# EasyEDA Pro project ProDocument_N64 SpyDVI QSB Compat_2024-08-22.epro

# Schematic QSBC
Board Name: N64 SpyDVI QSB; Create Date: 2024-08-22; Page Name: Schematic; Project Name: SpyDVI-QSB; Schematic Name: Schematic1; Update Date: 2024-08-22; Add into BOM: yes; Company: Chobrenga; Convert to PCB: yes; Date: 2024-02-21; Draw By: Chobrenga; REV: 1.0C; Sheet: 1/1
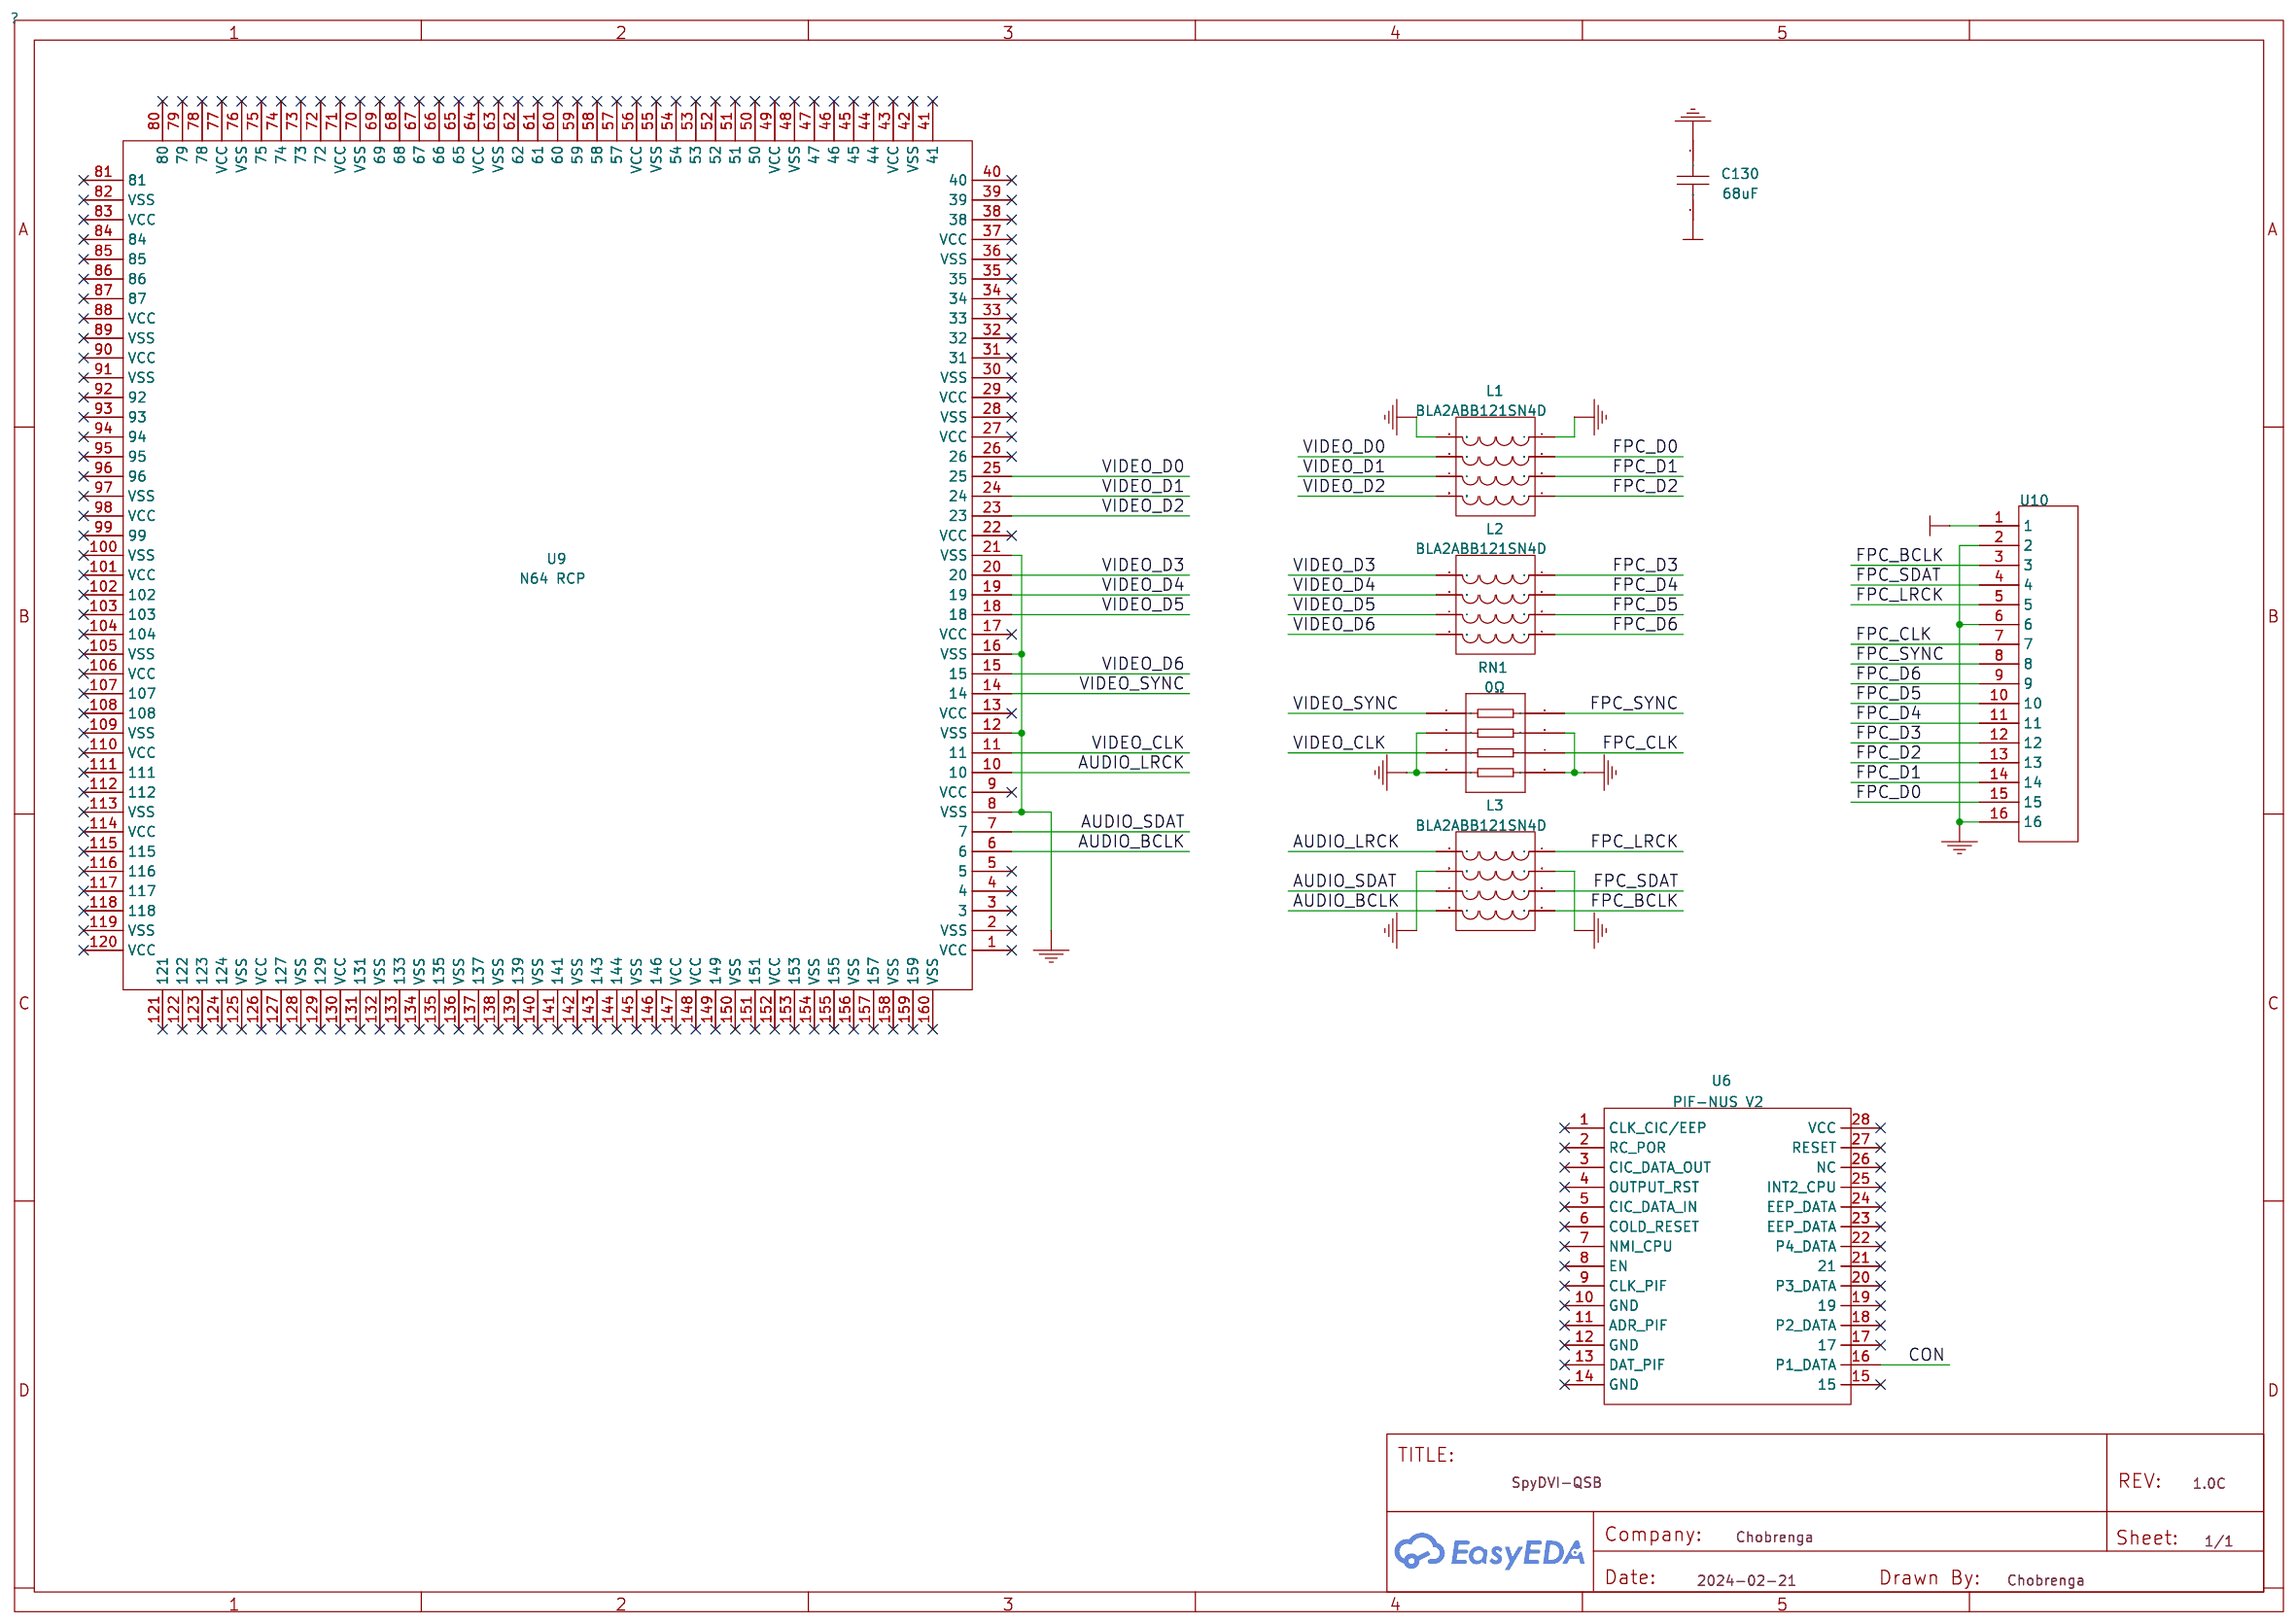
[diagram p0: schematic sheet]

## Parts
C130  68uF  (no BOM)
L1  BLA2ABB121SN4D  [BEAD-SMD_8P-L2.0-W1.0-P0.50-TL]
L2  BLA2ABB121SN4D  [BEAD-SMD_8P-L2.0-W1.0-P0.50-TL]
L3  BLA2ABB121SN4D  [BEAD-SMD_8P-L2.0-W1.0-P0.50-TL]
RN1  0Ω  [RES-ARRAY-SMD_0402-8P-L2.0-W1.0-BL]
U6  PIF-NUS V2  (no BOM)
U9  N64 RCP  [RCP NUS]  (no BOM)
U10  -  [16P_Ribbon]  (no BOM)

## Library data of the parts
C130 = 68uF
L1-L3 = BLA2ABB121SN4D: Supplier: LCSC; Supplier Part: C440126; Manufacturer: muRata(村田); JLCPCB Part Class: Extended Part
RN1 = 0Ω: Supplier: LCSC; Manufacturer: FH(风华); Manufacturer Part: RC-MT08W000JT; Supplier Part: C2001; JLCPCB Part Class: Extended Part
U6 = PIF-NUS V2
U9 = N64 RCP
U10 = 16P_Ribbon: For : AFA01-S16FCA-00

## Nets
+5V: C130.2 U10.1
GND: C130.1 L1.4 L1.5 L3.3 L3.6 RN1.1 RN1.3 RN1.6 RN1.8 U9.8(VSS) U9.12(VSS) U9.16(VSS) U9.21(VSS) U10.2 U10.6 U10.16
AUDIO_BCLK: L3.8 U9.6
AUDIO_LRCK: L3.5 U9.10
AUDIO_SDAT: L3.7 U9.7
CON: U6.16(P1 DATA)
FPC_BCLK: L3.1 U10.3
FPC_CLK: RN1.7 U10.7
FPC_D0: L1.3 U10.15
FPC_D1: L1.2 U10.14
FPC_D2: L1.1 U10.13
FPC_D3: L2.4 U10.12
FPC_D4: L2.3 U10.11
FPC_D5: L2.2 U10.10
FPC_D6: L2.1 U10.9
FPC_LRCK: L3.4 U10.5
FPC_SDAT: L3.2 U10.4
FPC_SYNC: RN1.5 U10.8
VIDEO_CLK: RN1.2 U9.11
VIDEO_D0: L1.6 U9.25
VIDEO_D1: L1.7 U9.24
VIDEO_D2: L1.8 U9.23
VIDEO_D3: L2.5 U9.20
VIDEO_D4: L2.6 U9.19
VIDEO_D5: L2.7 U9.18
VIDEO_D6: L2.8 U9.15
VIDEO_SYNC: RN1.4 U9.14

Not connected (* = marked no-connect by the designer): U6 1(CLK CIC/EEP)* 2(RC POR)* 3(CIC DATA OUT)* 4(OUTPUT RST)* 5(CIC DATA IN)* 6(COLD RESET)* 7(NMI_CPU)* 8(EN)* 9(CLK PIF)* 10(GND)* 11(ADR PIF)* 12(GND)* 13(DAT PIF)* 14(GND)* 15* 17* 18(P2 DATA)* 19* 20(P3 DATA)* 21* 22(P4 DATA)* 23(EEP DATA)* 24(EEP DATA)* 25(INT2 CPU)* 26(NC)* 27(RESET)* 28(VCC)*; U9 1(VCC)* 2(VSS)* 3* 4* 5* 9(VCC)* 13(VCC)* 17(VCC)* 22(VCC)* 26* 27(VCC)* 28(VSS)* 29(VCC)* 30(VSS)* 31* 32* 33* 34* 35* 36(VSS)* 37(VCC)* 38* 39* 40* 41* 42(VSS)* 43(VCC)* 44* 45* 46* 47* 48(VSS)* 49(VCC)* 50* 51* 52* 53* 54* 55(VSS)* 56(VCC)* 57* 58* 59* 60* 61* 62* 63(VSS)* 64(VCC)* 65* 66* 67* 68* 69* 70(VSS)* 71(VCC)* 72* 73* 74* 75* 76(VSS)* 77(VCC)* 78* 79* 80* 81* 82(VSS)* 83(VCC)* 84* 85* 86* 87* 88(VCC)* 89(VSS)* 90(VCC)* 91(VSS)* 92* 93* 94* 95* 96* 97(VSS)* 98(VCC)* 99* 100(VSS)* 101(VCC)* 102* 103* 104* 105(VSS)* 106(VCC)* 107* 108* 109(VSS)* 110(VCC)* 111* 112* 113(VSS)* 114(VCC)* 115* 116* 117* 118* 119(VSS)* 120(VCC)* 121* 122* 123* 124* 125(VSS)* 126(VCC)* 127* 128(VSS)* 129* 130(VCC)* 131* 132(VSS)* 133* 134(VSS)* 135* 136(VSS)* 137* 138(VSS)* 139* 140(VSS)* 141* 142(VSS)* 143* 144* 145(VSS)* 146* 147(VCC)* 148(VCC)* 149* 150(VSS)* 151* 152(VCC)* 153* 154(VSS)* 155* 156(VSS)* 157* 158(VSS)* 159* 160(VSS)*

# Board PCB_QSBC
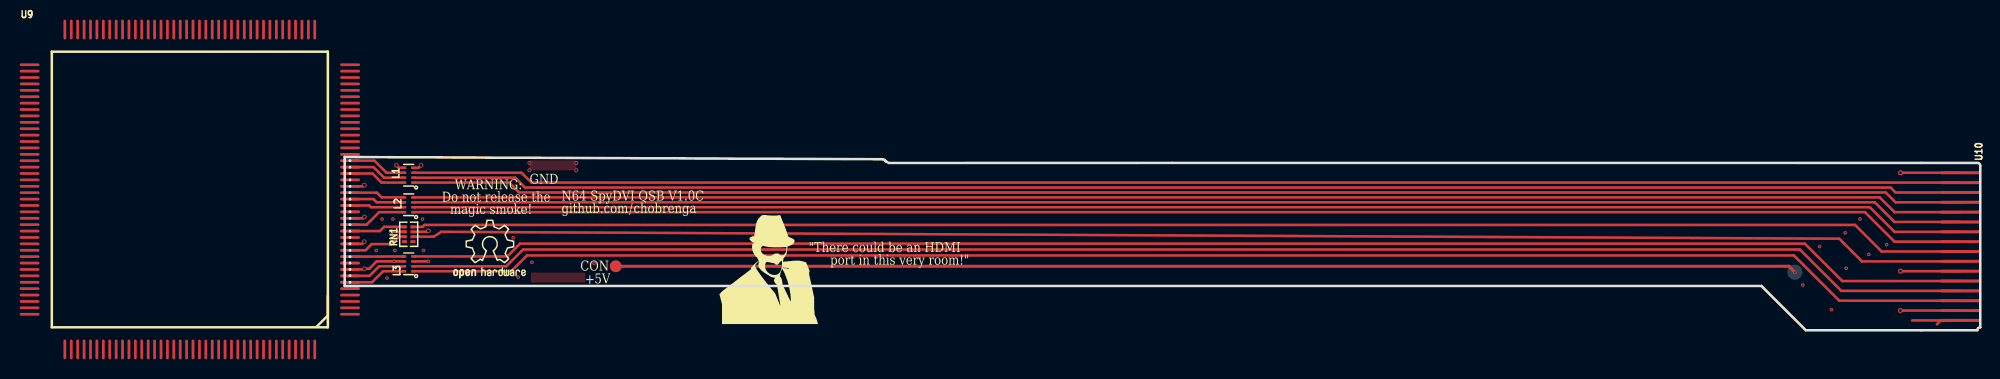
[diagram p1: board, top side]
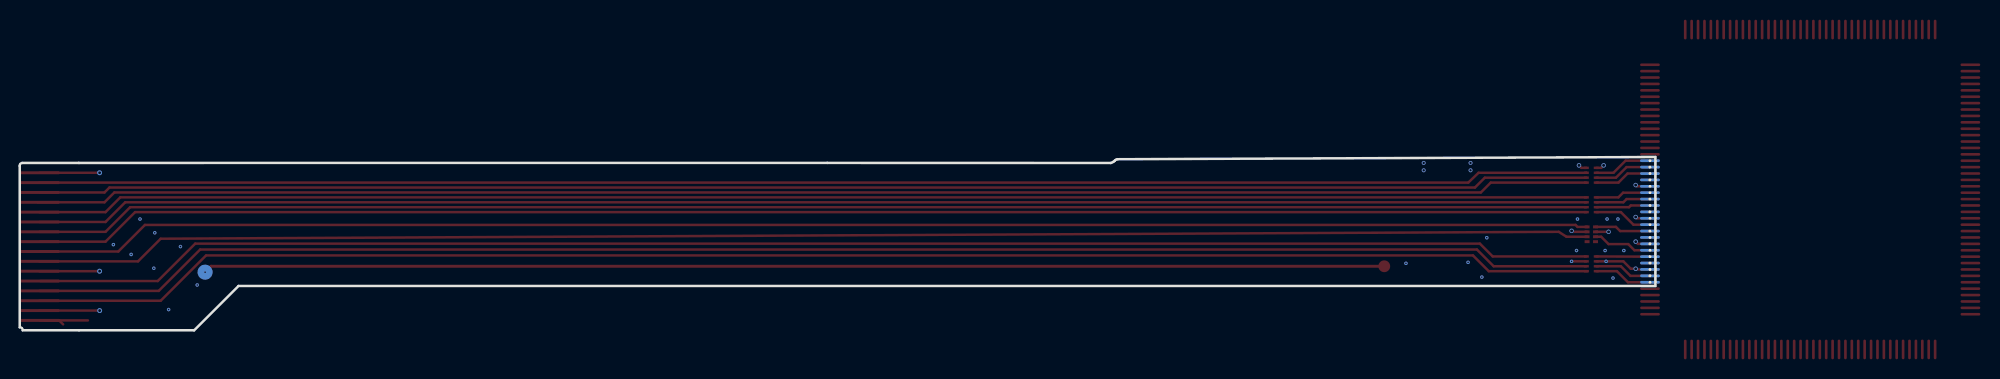
[diagram p2: board, bottom side, seen from below]

Outline 165.9 x 17.6 mm; copper layers: Top Layer, Bottom Layer. Coordinates in mm from the lower left corner of the outline.
Outline path: 159.9,17 84,17 55.24,17 arc(55.09,17.04) 54.96,17.12 54.84,17.22 arc(54.72,17.33) 54.56,17.38 54.55,17.38 0,17.6 0,4.5 143.7,4.5 148.2,0 159.9,0
Stack: Top Layer 0.035mm - / Dielectric1 0.01mm FR4 er 4.5 / Bottom Layer 0.035mm -

## Design rules (mm)
template: Custom Config
spacing copperThickness1oz (default): track to track 0.102, other pairs 0.152 to 0.3
spacing copperThickness2oz: track to track 0.203, other pairs 0.152 to 0.3
track width copperThickness1oz (default): min 0.127, default 0.254, max 2.54
track width copperThickness2oz: min 0.203, default 0.254, max 2.54
differential pair differentialPair (default): width min 0.127, default 0.254, max 2.54; gap min 0.152, default 0.152
via viaSize (default): diameter min 0.35, default 0.61, max 10; hole min 0.15, default 0.305, max 6.3

## Placement (name value [footprint] x y rotation side)
L1  BLA2ABB121SN4D  [BEAD-SMD_8P-L2.0-W1.0-P0.50-TL]  6.5 15.75 90 top
L2  BLA2ABB121SN4D  [BEAD-SMD_8P-L2.0-W1.0-P0.50-TL]  6.5 12.75 90 top
L3  BLA2ABB121SN4D  [BEAD-SMD_8P-L2.0-W1.0-P0.50-TL]  6.5 6.75 90 top
NOREF  -  [Pad_e166]  27.5 6.5 0 top
NOREF#2  -  [Pad_e275]  147.1 5.9 0 top
RN1  0Ω  [RES-ARRAY-SMD_0402-8P-L2.0-W1.0-BL]  6.5 9.75 90 top
U9  N64 RCP  [RCP NUS]  -15.7 14.3 0 top
U10  -  [16P_Ribbon]  163.9 8.5 270 top

## Footprints (pads in the part's own frame, mm; a bottom-side part is the same pattern mirrored in y, then rotated)
16P_Ribbon
  rect 0.3x4 smd: 1(7.5,0) 2(6.5,0) 3(5.5,0) 4(4.5,0) 5(3.5,0) 6(2.5,0) 7(1.5,0) 8(0.5,0) 9(-0.5,0) 10(-1.5,0) 11(-2.5,0) 12(-3.5,0) 13(-4.5,0) 14(-5.5,0) 15(-6.5,0) 16(-7.5,0)
BEAD-SMD_8P-L2.0-W1.0-P0.50-TL
  rect 0.25x0.5 smd: 1(-0.75,-0.5) 2(-0.25,-0.5) 3(0.25,-0.5) 4(0.75,-0.5) 5(0.75,0.5) 6(0.25,0.5) 7(-0.25,0.5) 8(-0.75,0.5)
Pad_e166
  round 1.2 smd: 1(0,0)
Pad_e275
  round 1.524 smd far side: 1(0,0)
RCP NUS
  oval 2x0.27 smd: 1(16.247,-12.673) 2(16.247,-12.024) 3(16.247,-11.373) 4(16.247,-10.723) 5(16.247,-10.073) 26(16.252,3.575) 27(16.252,4.224) 28(16.252,4.874) 29(16.253,5.524) 30(16.253,6.174) 31(16.253,6.824) 32(16.253,7.473) 33(16.253,8.123) 34(16.253,8.774) 35(16.253,9.424) 36(16.253,10.073) 37(16.253,10.723) 38(16.253,11.373) 39(16.253,12.023) 40(16.253,12.673) 81(-16.247,12.673) 82(-16.247,12.024) 83(-16.247,11.373) 84(-16.247,10.723) 85(-16.247,10.073) 86(-16.247,9.424) 87(-16.248,8.774) 88(-16.247,8.123) 89(-16.248,7.473) 90(-16.248,6.824) 91(-16.248,6.174) 92(-16.248,5.524) 93(-16.249,4.874) 94(-16.249,4.224) 95(-16.249,3.574) 96(-16.249,2.924) 97(-16.25,2.275) 98(-16.25,1.625) 99(-16.25,0.975) 100(-16.25,0.325) 101(-16.25,-0.325) 102(-16.251,-0.975) 103(-16.251,-1.625) 104(-16.251,-2.275) 105(-16.251,-2.925) 106(-16.251,-3.575) 107(-16.252,-4.224) 108(-16.252,-4.875) 109(-16.252,-5.524) 110(-16.252,-6.174) 111(-16.252,-6.824) 112(-16.252,-7.474) 113(-16.252,-8.124) 114(-16.252,-8.774) 115(-16.253,-9.424) 116(-16.253,-10.073) 117(-16.253,-10.723) 118(-16.253,-11.373) 119(-16.253,-12.023) 120(-16.253,-12.673)
  oval 2x0.27 hole 0.3: 6(16.247,-9.424) 7(16.248,-8.774) 8(16.247,-8.123) 9(16.248,-7.473) 10(16.248,-6.824) 11(16.248,-6.174) 12(16.248,-5.524) 13(16.249,-4.874) 14(16.25,-4.224) 15(16.25,-3.574) 16(16.25,-2.925) 17(16.25,-2.275) 18(16.25,-1.625) 19(16.25,-0.975) 20(16.25,-0.325) 21(16.25,0.325) 22(16.251,0.975) 23(16.252,1.625) 24(16.252,2.275) 25(16.252,2.925)
  oval 0.27x2 smd: 41(12.673,16.247) 42(12.024,16.247) 43(11.373,16.247) 44(10.723,16.247) 45(10.074,16.247) 46(9.424,16.247) 47(8.774,16.248) 48(8.123,16.247) 49(7.473,16.248) 50(6.824,16.248) 51(6.174,16.248) 52(5.524,16.248) 53(4.874,16.249) 54(4.224,16.249) 55(3.574,16.249) 56(2.925,16.25) 57(2.275,16.25) 58(1.625,16.25) 59(0.975,16.25) 60(0.325,16.25) 61(-0.325,16.25) 62(-0.975,16.251) 63(-1.625,16.251) 64(-2.275,16.251) 65(-2.925,16.251) 66(-3.575,16.251) 67(-4.224,16.252) 68(-4.874,16.252) 69(-5.524,16.252) 70(-6.174,16.252) 71(-6.824,16.252) 72(-7.474,16.252) 73(-8.123,16.252) 74(-8.774,16.252) 75(-9.423,16.253) 76(-10.073,16.253) 77(-10.723,16.253) 78(-11.373,16.253) 79(-12.023,16.253) 80(-12.673,16.253) 121(-12.673,-16.247) 122(-12.023,-16.247) 123(-11.373,-16.247) 124(-10.723,-16.247) 125(-10.073,-16.247) 126(-9.424,-16.247) 127(-8.774,-16.248) 128(-8.123,-16.247) 129(-7.473,-16.248) 130(-6.824,-16.248) 131(-6.174,-16.248) 132(-5.524,-16.248) 133(-4.874,-16.249) 134(-4.224,-16.249) 135(-3.574,-16.249) 136(-2.925,-16.25) 137(-2.275,-16.25) 138(-1.625,-16.25) 139(-0.975,-16.25) 140(-0.325,-16.25) 141(0.325,-16.25) 142(0.975,-16.252) 143(1.625,-16.252) 144(2.275,-16.252) 145(2.925,-16.252) 146(3.575,-16.252) 147(4.224,-16.252) 148(4.874,-16.253) 149(5.524,-16.253) 150(6.174,-16.253) 151(6.824,-16.253) 152(7.474,-16.253) 153(8.123,-16.253) 154(8.774,-16.253) 155(9.424,-16.253) 156(10.073,-16.253) 157(10.723,-16.253) 158(11.373,-16.253) 159(12.024,-16.253) 160(12.673,-16.253)
RES-ARRAY-SMD_0402-8P-L2.0-W1.0-BL
  rect 0.3x0.505 smd: 1(-0.75,0.427) 2(-0.25,0.427) 3(0.25,0.427) 4(0.75,0.427) 5(0.75,-0.427) 6(0.25,-0.427) 7(-0.25,-0.427) 8(-0.75,-0.427)

## Nets
As in the schematic, except:
FPC_CON: NOREF.1 NOREF#2.1

Pads without a net: U9 1 2 3 4 5 9 13 17 22 26 27 28 29 30 31 32 33 34 35 36 37 38 39 40 41 42 43 44 45 46 47 48 49 50 51 52 53 54 55 56 57 58 59 60 61 62 63 64 65 66 67 68 69 70 71 72 73 74 75 76 77 78 79 80 81 82 83 84 85 86 87 88 89 90 91 92 93 94 95 96 97 98 99 100 101 102 103 104 105 106 107 108 109 110 111 112 113 114 115 116 117 118 119 120 121 122 123 124 125 126 127 128 129 130 131 132 133 134 135 136 137 138 139 140 141 142 143 144 145 146 147 148 149 150 151 152 153 154 155 156 157 158 159 160

## Via types
v1: diameter 0.35, hole 0.18, Top Layer to Bottom Layer, 22 vias
v2: diameter 0.4, hole 0.25, Top Layer to Bottom Layer, 4 vias
v3: diameter 0.45, hole 0.31, Top Layer to Bottom Layer, 8 vias
v4: diameter 0.5, hole 0.3, Top Layer to Bottom Layer, 3 vias

## Routing (per net, layer and track width the routed paths; a pad name or vN(x,y) marks a point on that pad's centre or on a via; arc(x,y) is an arc through that point)
GND: length 35
  Top Layer w0.254: U10.16 v4(157.8,16) ; U10.6 v4(157.8,6) ; U10.2 v4(157.8,2) ; 0.5,14.63 1.87,14.63 v3(2,14.75) ; 8.5,7 7,7 ; 6.07,10 4.75,10 ; 0.5,8.78 1.78,8.78 v3(2,9) ; 7,16.5 7.5,16.5 7.75,16.75 ; 0.5,6.18 1.93,6.18 2,6.25 2.5,6.25 3.25,7 6,7 ; 6.93,10 8.4,10 8.5,10.1 ; v3(2,11.5) 1.88,11.38 0.5,11.38 ; v3(5.25,16.75) 5.5,16.5 6,16.5
  vias: v1(3.2,8.1) v1(3.8,11.3) v1(4.3,5.3) v1(4.9,11.3) v1(5,7) v1(5.1,8.1) v1(7.9,11.3) v1(8,8.1) v1(8.5,7) v1(17.1,9.4) v1(17.6,5.4) v1(19,6.9) v1(25.3,6.8) v1(147.9,4.6) v1(149.6,8.5) v1(150.8,2.1) v1(152.2,9.9) v1(152.3,6.3) v1(153.7,11.3) v1(154.6,7.7) v1(156.4,8.7) v2(18.75,17) v2(18.75,16.25) v2(23.5,17) v2(23.5,16.25) v3(2,6.25) v3(4.75,10) v3(7.75,16.75) v3(8.5,10.1)
AUDIO_BCLK: length 6
  Top Layer w0.254: L3.8 3.9,6 2.78,4.88 0.5,4.88
AUDIO_LRCK: length 5.5
  Top Layer w0.254: 0.5,7.48 L3.5
AUDIO_SDAT: length 5.9
  Top Layer w0.254: 6,6.5 3.5,6.5 2.53,5.53 0.5,5.53
FPC_CON: length 119.8
  Top Layer w0.3: v1(147.1,5.9) 146.5,6.5 NOREF.1
VIDEO_CLK: length 6.1
  Top Layer w0.254: 0.5,8.13 2.13,8.13 2.75,8.75 4.75,8.75 5.5,9.5 6.07,9.5
VIDEO_D0: length 6
  Top Layer w0.254: 0.5,17.23 3.03,17.23 4.25,16 L1.6
VIDEO_D1: length 5.9
  Top Layer w0.254: L1.7 4,15.5 2.93,16.58 0.5,16.58
VIDEO_D2: length 5.9
  Top Layer w0.254: L1.8 3.75,15 2.82,15.92 0.5,15.92
VIDEO_D3: length 5.7
  Top Layer w0.254: 0.5,13.98 3.27,13.98 3.75,13.5 6,13.5
VIDEO_D4: length 5.6
  Top Layer w0.254: 6,13 3.25,13 2.93,13.33 0.5,13.33
VIDEO_D5: length 5.6
  Top Layer w0.254: L2.7 2.67,12.5 2.5,12.68 0.5,12.68
VIDEO_D6: length 6
  Top Layer w0.254: 0.5,10.73 2.22,10.73 3.5,12 L2.8
VIDEO_SYNC: length 5.7
  Top Layer w0.254: 6.07,10.5 4,10.5 3.58,10.08 0.5,10.08
+5V: length 7
  Top Layer w0.254: 161.5,0.6 161.9,1 163.42,1 ; U10.1 158.99,1
FPC_BCLK: length 159.6
  Top Layer w0.254: 6.9,6 16.9,6 18.5,7.6 147,7.6 151.6,3 U10.3
FPC_CLK: length 158.1
  Top Layer w0.254: RN1.7 9.02,9.5 9.8,10 151.6,9.3 153.9,7 U10.7
FPC_D0: length 157.3
  Top Layer w0.254: L1.3 17.93,16 18.98,15 U10.15
FPC_D1: length 157.5
  Top Layer w0.254: L1.2 17.3,15.5 18.3,14.5 156.8,14.5 157.3,14 U10.14
FPC_D2: length 157.9
  Top Layer w0.254: L1.1 16.7,15 17.7,14 156.3,14 157.3,13 164.1,13
FPC_D3: length 157.5
  Top Layer w0.254: L2.4 155.7,13.5 157.2,12 U10.12
FPC_D4: length 157.7
  Top Layer w0.254: L2.3 155.2,13 157.2,11 U10.11
FPC_D5: length 157.9
  Top Layer w0.254: L2.2 154.7,12.5 157.2,10 U10.10
FPC_D6: length 158.1
  Top Layer w0.254: L2.1 154.2,12 157.2,9 U10.9
FPC_LRCK: length 158.9
  Top Layer w0.254: L3.4 16.5,7.5 17.8,8.8 148.1,8.8 151.9,5 163.8,5
FPC_SDAT: length 159.3
  Top Layer w0.254: L3.2 16.4,6.5 18.1,8.2 147.6,8.2 151.8,4 U10.4
FPC_SYNC: length 158.2
  Top Layer w0.254: RN1.5 7.9,10.5 8.1,10.7 153.2,10.7 155.9,8 U10.8

## Copper pours and planes (outline as drawn; the poured copper is in the pictures)
+5V on Top Layer: 18.9,5.85 24.4,5.85 24.4,4.85 18.9,4.85
+5V on Top Layer: 144.8,6.11 149.39,1.4 166.1,1.4 166.1,-0.16 147.78,-0.16 144.8,2.93 79.6,1.95 78.6,2.45 49.1,3.95 18.5,3.95 18.5,6.21
GND on Top Layer: 0.38,20.83 0.25,1.45 145,3.6 149,-0.3 161.95,-0.3 161.95,18.08
GND on Top Layer: 18.75,17.25 23.5,17.25 23.5,16.25 18.75,16.25
GND on Bottom Layer: -1,21.5 -1,3.25 0,2.25 143.9,3.6 147.6,-0.6 161.1,-0.7 161.1,17.62

## Text on the board
Top Silkscreen Layer: N64 SpyDVI QSB V1.0C | github.com/chobrenga | "There could be an HDMI | port in this very room!" | Do not release the | magic smoke! | WARNING: | GND | CON | +5V
